# EAGLE schematic NEW IR (EAGLE 9.6.2)

## Sheet 1 of 4
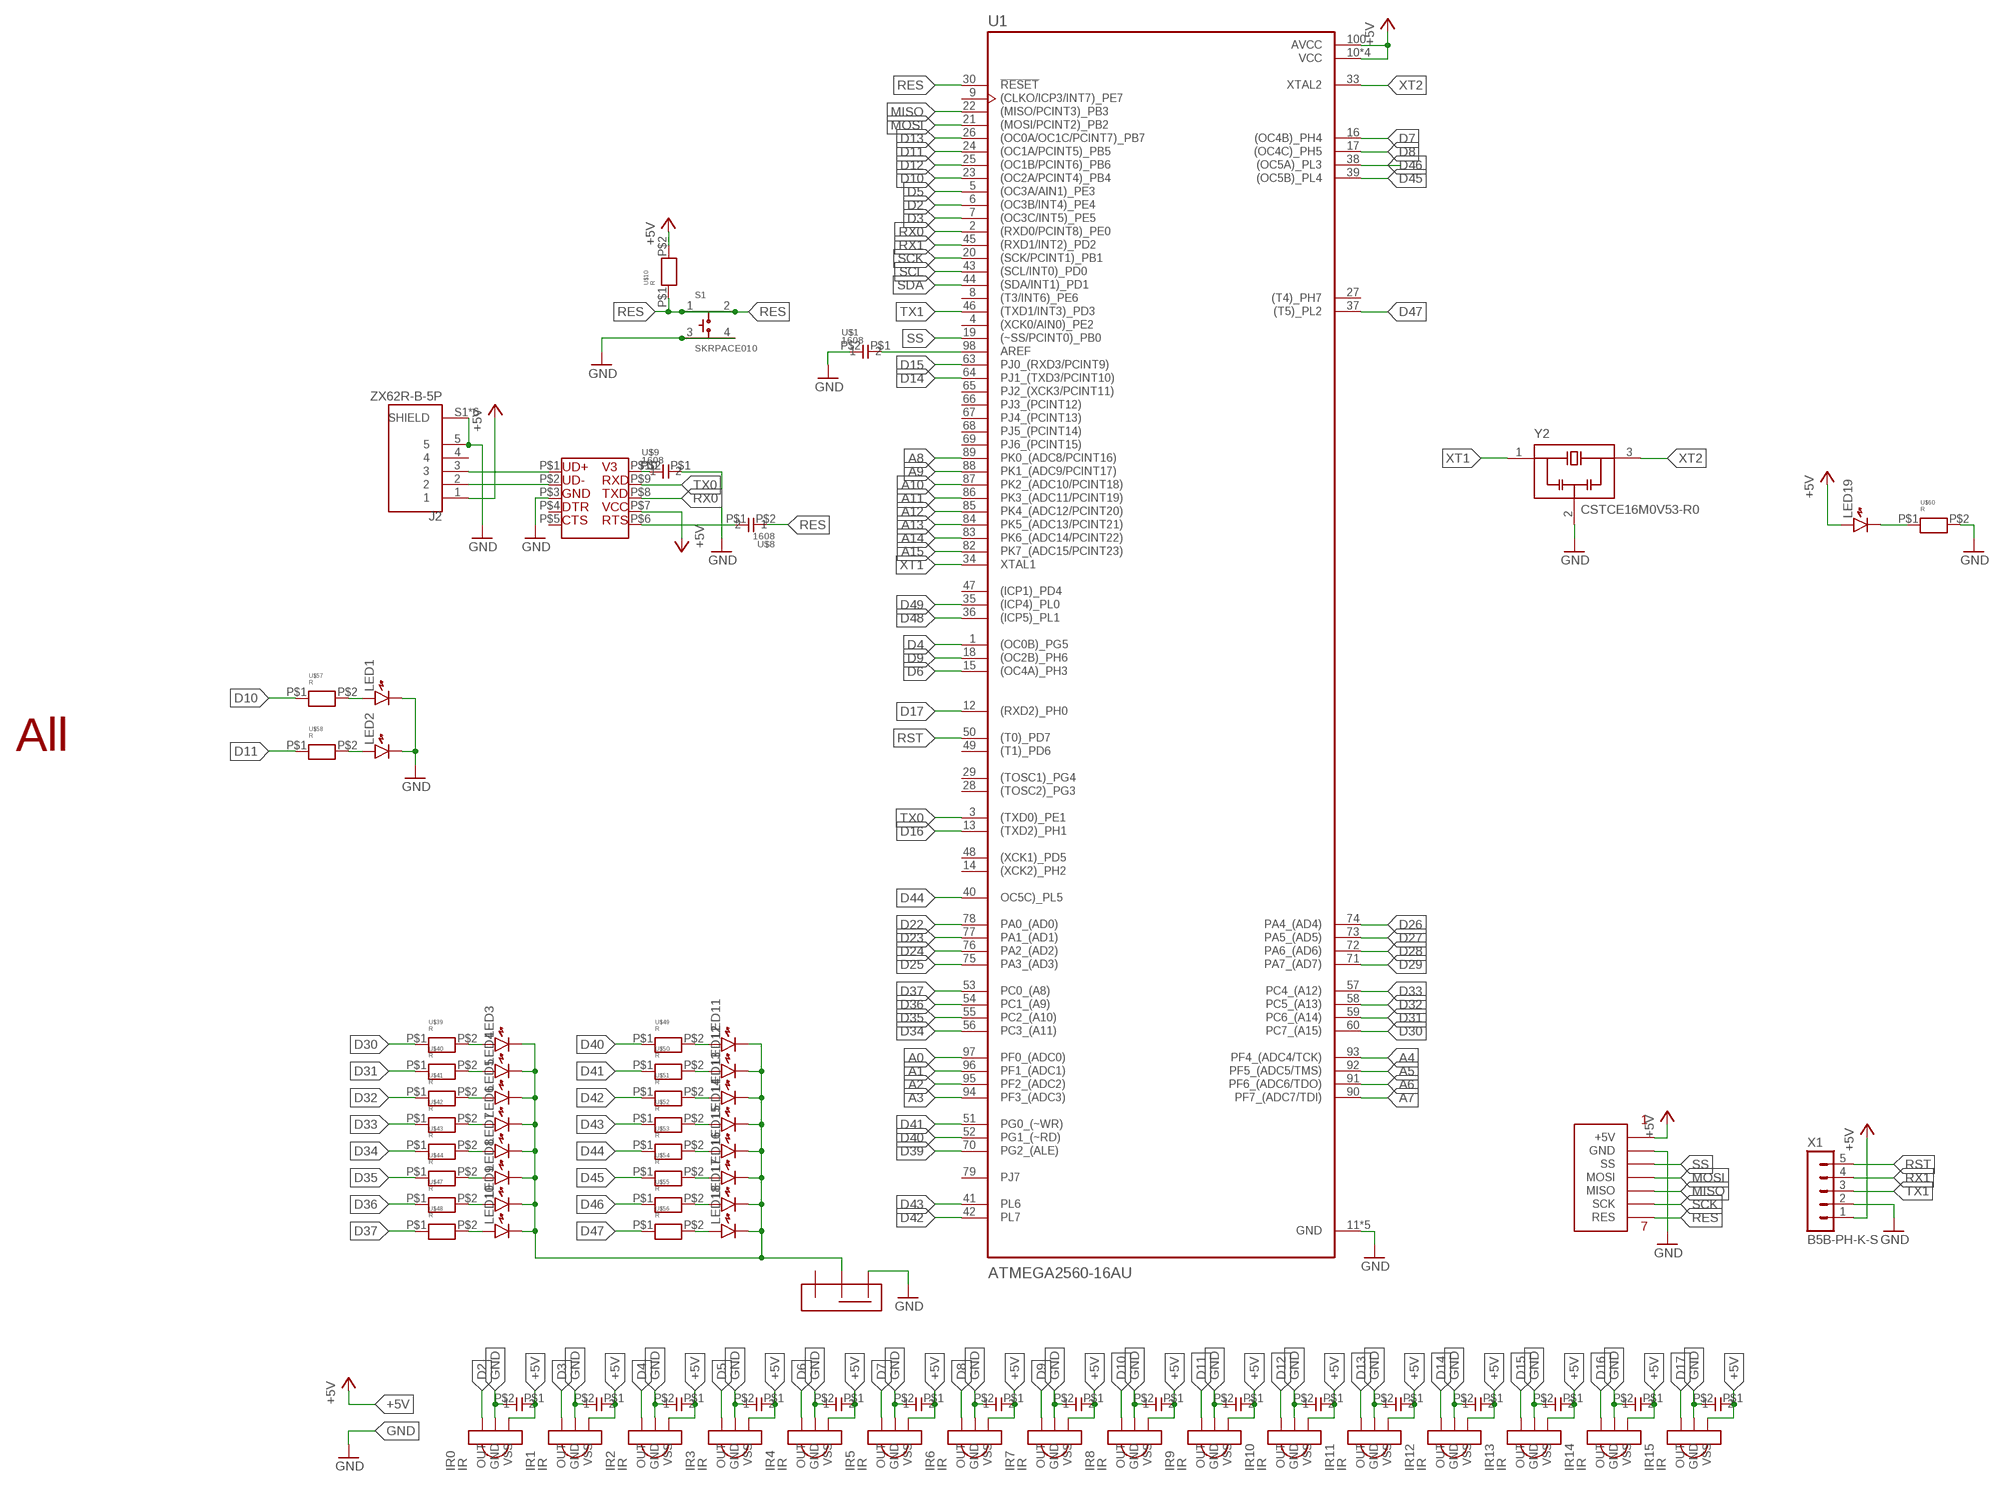
[diagram p0: schematic, sheet 1]

### Parts
IR0  IR  [IR]
IR1  IR  [IR]
IR2  IR  [IR]
IR3  IR  [IR]
IR4  IR  [IR]
IR5  IR  [IR]
IR6  IR  [IR]
IR7  IR  [IR]
IR8  IR  [IR]
IR9  IR  [IR]
IR10  IR  [IR]
IR11  IR  [IR]
IR12  IR  [IR]
IR13  IR  [IR]
IR14  IR  [IR]
IR15  IR  [IR]
J2  ZX62R-B-5P  [HRS_ZX62R-B-5P]
LED1  LED1608  [LED1608]
LED2  LED1608  [LED1608]
LED3  LED1608  [LED1608]
LED4  LED1608  [LED1608]
LED5  LED1608  [LED1608]
LED6  LED1608  [LED1608]
LED7  LED1608  [LED1608]
LED8  LED1608  [LED1608]
LED9  LED1608  [LED1608]
LED10  LED1608  [LED1608]
LED11  LED1608  [LED1608]
LED12  LED1608  [LED1608]
LED13  LED1608  [LED1608]
LED14  LED1608  [LED1608]
LED15  LED1608  [LED1608]
LED16  LED1608  [LED1608]
LED17  LED1608  [LED1608]
LED18  LED1608  [LED1608]
LED19  LED1608  [LED1608]
S1  SKRPACE010  [SW_SKRPACE010]
U1  ATMEGA2560-16AU  [QFP50P1600X1600X120-100N]
U$1  1608  [CON]
U$2  1608  [CON]
U$3  ALL  [ALL]
U$4  1608  [CON]
U$5  SSW  [SSW]
U$6  1608  [CON]
U$7  CH340K  [CH340K]
U$8  1608  [CON]
U$9  1608  [CON]
U$10  R  [1608]
U$14  1608  [CON]
U$16  1608  [CON]
U$18  1608  [CON]
U$20  1608  [CON]
U$22  1608  [CON]
U$24  1608  [CON]
U$26  1608  [CON]
U$28  1608  [CON]
U$30  1608  [CON]
U$32  1608  [CON]
U$34  1608  [CON]
U$36  1608  [CON]
U$38  1608  [CON]
U$39  R  [1608]
U$40  R  [1608]
U$41  R  [1608]
U$42  R  [1608]
U$43  R  [1608]
U$44  R  [1608]
U$47  R  [1608]
U$48  R  [1608]
U$49  R  [1608]
U$50  R  [1608]
U$51  R  [1608]
U$52  R  [1608]
U$53  R  [1608]
U$54  R  [1608]
U$55  R  [1608]
U$56  R  [1608]
U$57  R  [1608]
U$58  R  [1608]
U$59  SPI  [SPI]
U$60  R  [1608]
X1  B5B-PH-K-S  [B5B-PH-K-S]
Y2  CSTCE16M0V53-R0  [OSC_CSTCE16M0V53-R0]

### Nets
+5V: IR0.P$3(VSS) IR1.P$3(VSS) IR2.P$3(VSS) IR3.P$3(VSS) IR4.P$3(VSS) IR5.P$3(VSS) IR6.P$3(VSS) IR7.P$3(VSS) IR8.P$3(VSS) IR9.P$3(VSS) IR10.P$3(VSS) IR11.P$3(VSS) IR12.P$3(VSS) IR13.P$3(VSS) IR14.P$3(VSS) IR15.P$3(VSS) J2.1 LED19.A U1.10(VCC) U1.31(VCC) U1.61(VCC) U1.80(VCC) U1.100(AVCC) U$2.P$1 U$4.P$1 U$6.P$1 U$7.P$7 U$10.P$2 U$14.P$1 U$16.P$1 U$18.P$1 U$20.P$1 U$22.P$1 U$24.P$1 U$26.P$1 U$28.P$1 U$30.P$1 U$32.P$1 U$34.P$1 U$36.P$1 U$38.P$1 U$59.P$1(+5V) X1.1
A0: U1.97(PF0_(ADC0))
A1: U1.96(PF1_(ADC1))
A2: U1.95(PF2_(ADC2))
A3: U1.94(PF3_(ADC3))
A4: U1.93(PF4_(ADC4/TCK))
A5: U1.92(PF5_(ADC5/TMS))
A6: U1.91(PF6_(ADC6/TDO))
A7: U1.90(PF7_(ADC7/TDI))
A8: U1.89(PK0_(ADC8/PCINT16))
A9: U1.88(PK1_(ADC9/PCINT17))
A10: U1.87(PK2_(ADC10/PCINT18))
A11: U1.86(PK3_(ADC11/PCINT19))
A12: U1.85(PK4_(ADC12/PCINT20))
A13: U1.84(PK5_(ADC13/PCINT21))
A14: U1.83(PK6_(ADC14/PCINT22))
A15: U1.82(PK7_(ADC15/PCINT23))
D2: IR0.P$1(OUT) U1.6((OC3B/INT4)_PE4)
D3: IR1.P$1(OUT) U1.7((OC3C/INT5)_PE5)
D4: IR2.P$1(OUT) U1.1((OC0B)_PG5)
D5: IR3.P$1(OUT) U1.5((OC3A/AIN1)_PE3)
D6: IR4.P$1(OUT) U1.15((OC4A)_PH3)
D7: IR5.P$1(OUT) U1.16((OC4B)_PH4)
D8: IR6.P$1(OUT) U1.17((OC4C)_PH5)
D9: IR7.P$1(OUT) U1.18((OC2B)_PH6)
D10: IR8.P$1(OUT) U1.23((OC2A/PCINT4)_PB4) U$57.P$1
D11: IR9.P$1(OUT) U1.24((OC1A/PCINT5)_PB5) U$58.P$1
D12: IR10.P$1(OUT) U1.25((OC1B/PCINT6)_PB6)
D13: IR11.P$1(OUT) U1.26((OC0A/OC1C/PCINT7)_PB7)
D14: IR12.P$1(OUT) U1.64(PJ1_(TXD3/PCINT10))
D15: IR13.P$1(OUT) U1.63(PJ0_(RXD3/PCINT9))
D16: IR14.P$1(OUT) U1.13((TXD2)_PH1)
D17: IR15.P$1(OUT) U1.12((RXD2)_PH0)
D22: U1.78(PA0_(AD0))
D23: U1.77(PA1_(AD1))
D24: U1.76(PA2_(AD2))
D25: U1.75(PA3_(AD3))
D26: U1.74(PA4_(AD4))
D27: U1.73(PA5_(AD5))
D28: U1.72(PA6_(AD6))
D29: U1.71(PA7_(AD7))
D30: U1.60(PC7_(A15)) U$39.P$1
D31: U1.59(PC6_(A14)) U$40.P$1
D32: U1.58(PC5_(A13)) U$41.P$1
D33: U1.57(PC4_(A12)) U$42.P$1
D34: U1.56(PC3_(A11)) U$43.P$1
D35: U1.55(PC2_(A10)) U$44.P$1
D36: U1.54(PC1_(A9)) U$47.P$1
D37: U1.53(PC0_(A8)) U$48.P$1
D39: U1.70(PG2_(ALE))
D40: U1.52(PG1_(~RD)) U$49.P$1
D41: U1.51(PG0_(~WR)) U$50.P$1
D42: U1.42(PL7) U$51.P$1
D43: U1.41(PL6) U$52.P$1
D44: U1.40(OC5C)_PL5) U$53.P$1
D45: U1.39((OC5B)_PL4) U$54.P$1
D46: U1.38((OC5A)_PL3) U$55.P$1
D47: U1.37((T5)_PL2) U$56.P$1
D48: U1.36((ICP5)_PL1)
D49: U1.35((ICP4)_PL0)
GND: IR0.P$2(GND) IR1.P$2(GND) IR2.P$2(GND) IR3.P$2(GND) IR4.P$2(GND) IR5.P$2(GND) IR6.P$2(GND) IR7.P$2(GND) IR8.P$2(GND) IR9.P$2(GND) IR10.P$2(GND) IR11.P$2(GND) IR12.P$2(GND) IR13.P$2(GND) IR14.P$2(GND) IR15.P$2(GND) J2.5 J2.S1(SHIELD) J2.S2(SHIELD) J2.S3(SHIELD) J2.S4(SHIELD) J2.S5(SHIELD) J2.S6(SHIELD) LED1.K LED2.K S1.3 S1.4 U1.11(GND) U1.32(GND) U1.62(GND) U1.81(GND) U1.99(GND) U$1.P$2 U$2.P$2 U$4.P$2 U$5.P$1 U$6.P$2 U$7.P$3 U$9.P$1 U$14.P$2 U$16.P$2 U$18.P$2 U$20.P$2 U$22.P$2 U$24.P$2 U$26.P$2 U$28.P$2 U$30.P$2 U$32.P$2 U$34.P$2 U$36.P$2 U$38.P$2 U$59.P$2(GND) U$60.P$2 X1.2 Y2.2(GND)
MISO: U1.22((MISO/PCINT3)_PB3) U$59.P$5(MISO)
MOSI: U1.21((MOSI/PCINT2)_PB2) U$59.P$4(MOSI)
N$1: LED3.A U$39.P$2
N$2: LED4.A U$40.P$2
N$3: LED5.A U$41.P$2
N$4: LED6.A U$42.P$2
N$5: LED7.A U$43.P$2
N$6: LED8.A U$44.P$2
N$7: LED9.A U$47.P$2
N$9: LED2.A U$58.P$2
N$10: LED1.A U$57.P$2
N$11: LED3.K LED4.K LED5.K LED6.K LED7.K LED8.K LED9.K LED10.K LED11.K LED12.K LED13.K LED14.K LED15.K LED16.K LED17.K LED18.K U$5.P$3
N$12: U$7.P$6 U$8.P$1
N$16: J2.2 U$7.P$2
N$17: J2.3 U$7.P$1
N$18: U$7.P$10 U$9.P$2
N$22: LED10.A U$48.P$2
N$24: LED11.A U$49.P$2
N$25: LED12.A U$50.P$2
N$26: LED13.A U$51.P$2
N$27: LED14.A U$52.P$2
N$28: LED15.A U$53.P$2
N$29: LED16.A U$54.P$2
N$30: LED17.A U$55.P$2
N$31: LED18.A U$56.P$2
N$37: LED19.K U$60.P$1
N$46: U1.98(AREF) U$1.P$1
RES: S1.1 S1.2 U1.30(!RESET) U$8.P$2 U$10.P$1 U$59.P$7(RES)
RST: U1.50((T0)_PD7) X1.5
RX0: U1.2((RXD0/PCINT8)_PE0) U$7.P$8
RX1: U1.45((RXD1/INT2)_PD2) X1.4
SCK [New Class]: U1.20((SCK/PCINT1)_PB1) U$59.P$6(SCK)
SCL: U1.43((SCL/INT0)_PD0)
SDA: U1.44((SDA/INT1)_PD1)
SS: U1.19((~SS/PCINT0)_PB0) U$59.P$3(SS)
TX0: U1.3((TXD0)_PE1) U$7.P$9
TX1: U1.46((TXD1/INT3)_PD3) X1.3
XT1: U1.34(XTAL1) Y2.1(IN)
XT2: U1.33(XTAL2) Y2.3(OUT)
Unconnected: J2.4 U1.4((XCK0/AIN0)_PE2) U1.8((T3/INT6)_PE6) U1.9((CLKO/ICP3/INT7)_PE7) U1.14((XCK2)_PH2) U1.27((T4)_PH7) U1.28((TOSC2)_PG3) U1.29((TOSC1)_PG4) U1.47((ICP1)_PD4) U1.48((XCK1)_PD5) U1.49((T1)_PD6) U1.65(PJ2_(XCK3/PCINT11)) U1.66(PJ3_(PCINT12)) U1.67(PJ4_(PCINT13)) U1.68(PJ5_(PCINT14)) U1.69(PJ6_(PCINT15)) U1.79(PJ7) U$5.P$2 U$7.P$4 U$7.P$5

## Sheet 2 of 4

## Sheet 3 of 4

## Sheet 4 of 4

## Library data of the parts
IR0 IR1-IR15 = IR:IR
J2 = USBMicro:ZX62R-B-5P: Conn Micro USB 2.0 Type B RCP 5 POS 0.65mm Solder RA SMD 5 Terminal 1 Port Embossed T/R Check prices <https://pricing.snapeda.com/parts/ZX62R-B-5P/Hirose/view-part?ref=eda>; AVAILABILITY: In Stock; DESCRIPTION: USB - micro B USB 2.0 Receptacle Connector 5 Position Surface Mount, Right Angle; MF: Hirose; MP: ZX62R-B-5P; PACKAGE: None; PRICE: None
LED1-LED19 = generic:LED: Generic LEDs
S1 = SKRPACE010:SKRPACE010: Switch Tactile N.O. SPST Button J-Bend 0.05A 16VDC 2.55N SMD Automotive T/R Check prices <https://pricing.snapeda.com/parts/SKRPACE010/ALPS/view-part?ref=eda>; AVAILABILITY: In Stock; DESCRIPTION: Switch Tactile N.O. SPST Button J-Bend 0.05A 16VDC 2.55N SMD Automotive T/R; MF: ALPS; MP: SKRPACE010; PACKAGE: None; PRICE: None
U1 = ATMEGA2560-16AU (1):ATMEGA2560-16AU: Check prices <https://pricing.snapeda.com/parts/ATMEGA2560-16AU/Microchip%20Technology/view-part?ref=eda>; AVAILABILITY: In Stock; DESCRIPTION: AVR AVR® ATmega Microcontroller IC 8-Bit 16MHz 256KB (128K x 16) FLASH 100-TQFP (14x14); MF: Microchip Technology; MP: ATMEGA2560-16AU; PACKAGE: None; PRICE: None; PURCHASE-URL: https://pricing.snapeda.com/search/part/ATMEGA2560-16AU/?ref=eda
U$1 U$2 U$4 U$6 U$8 U$9 U$14 U$16 U$18 U$20 U$22 U$24 U$26 U$28 U$30 U$32 U$34 U$36 U$38 = con1608:1608
U$3 = All_outlook:ALL
U$5 = SSW:SSW
U$7 = CH340K:CH340K
U$10 U$39-U$44 U$47-U$58 U$60 = R 1608:R
U$59 = SPI用PH7ピン:SPI
X1 = con-JST PH:B5B-PH: JST PH series header 2.00mm pitch disconnectable crimp style connectors, vertical (side entry type), 5 pins
Y2 = CSTCE16M0V53-R0:CSTCE16M0V53-R0: 20MHz Ceramic Resonator Built in Capacitor 15pF +/- 0.2% -40C - 125C Surface Mount; MANUFACTURER: Murata; MAXIMUM_PACKAGE_HEIGHT: 1.00mm; PARTREV: May 7, 2019; STANDARD: Manufacturer Recommendations

## Net classes
0 default: width 0.127 mm, clearance 0.254 mm